# Altium project SC942C.PrjPcb (part 2 of 2)

## Sheet SC942C_STORRM.SchDoc: Sorties TOR Relais Monostable
size 393 x 270 mm; CompanyName: Seccom; Address1: 521, rue du capt. François Garbit; Address2: 69440 Mornant; Address3: seccom@seccom.fr; Address4: www.seccom.fr; DocumentNumber: 5; SheetNumber: 5; SheetTotal: 8; PageSetup: Record=PageOptions|CenterHorizontal=True|CenterVertical=True|PrintScale=0.74|XCorrection=1.00|YCorrection=1.00|PrintKind=0|BorderSize=5000000|LeftOffset=0|BottomOffset=0|Orientation=2|PaperLength=1000|PaperWidth=1000|Scale=100|PaperSource=7|PrintQuality=-4|MediaType=1|DitherType=10|PaperKind=A4|PrintScaleMode=1
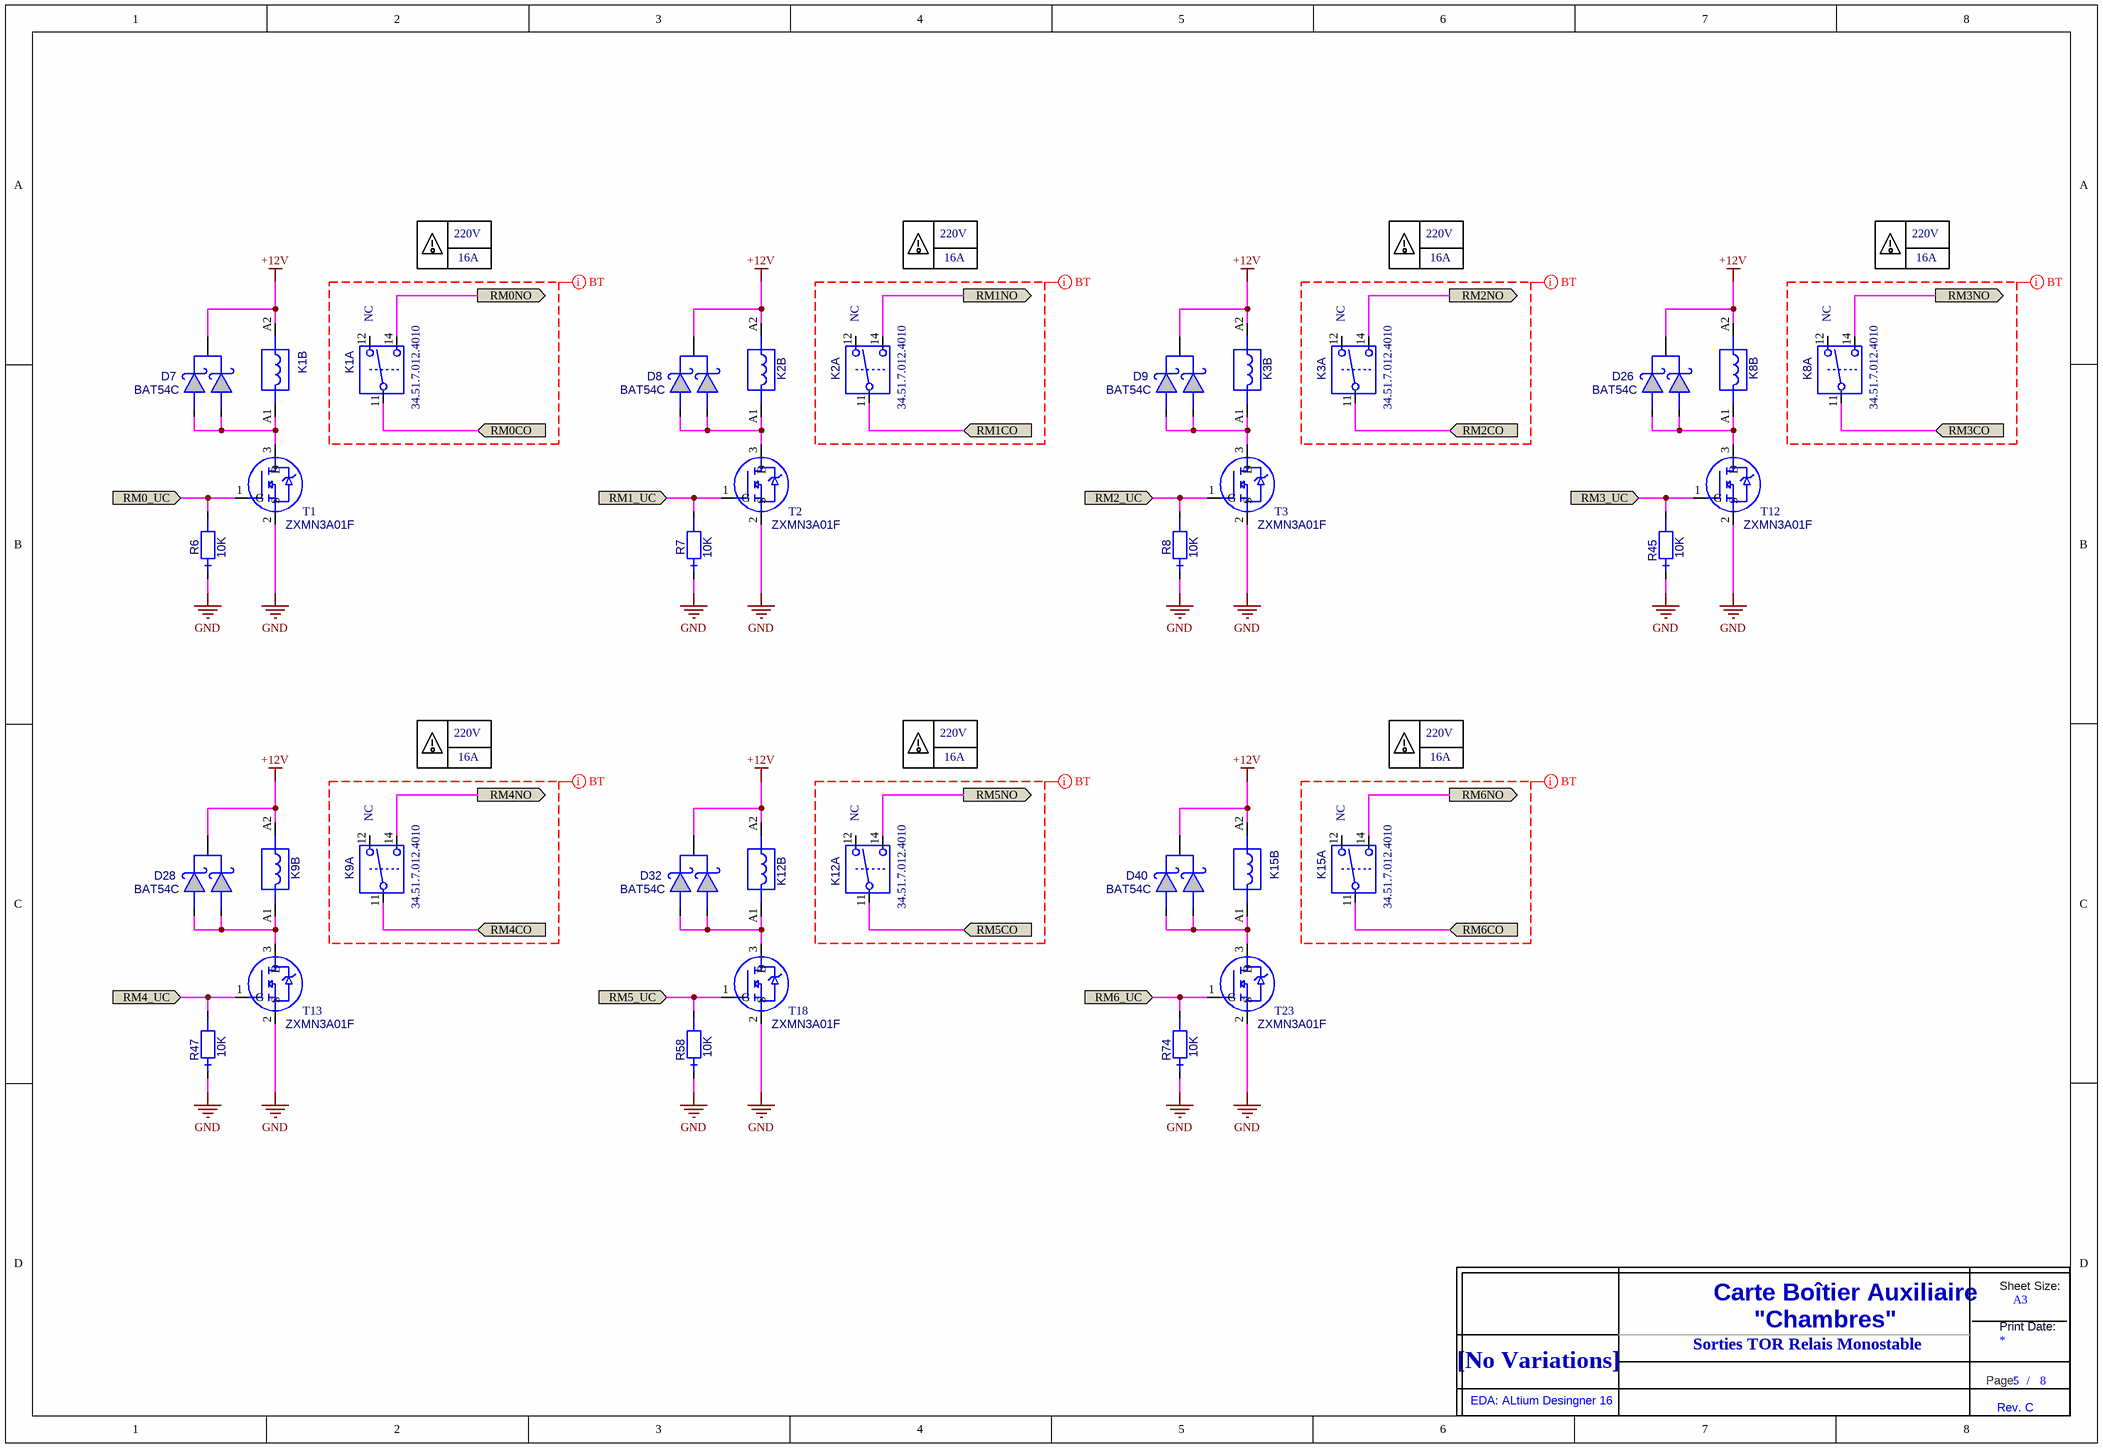
[diagram p5: SC942C_STORRM.SchDoc]

### Parts
(Parts that share a designator on the sheet are numbered #1, #2 ... from top to bottom, then left to right.)
D7  BAT54C  [SOT23_3L_ReflowSoldering]
D8  BAT54C  [SOT23_3L_ReflowSoldering]
D9  BAT54C  [SOT23_3L_ReflowSoldering]
D26  BAT54C  [SOT23_3L_ReflowSoldering]
D28  BAT54C  [SOT23_3L_ReflowSoldering]
D32  BAT54C  [SOT23_3L_ReflowSoldering]
D40  BAT54C  [SOT23_3L_ReflowSoldering]
K1  RELAY_12VDC_1RT_34.51  [RELAY_FINDER_34.51_+SUPPORT_93]  (value not drawn)  (parts A,B of 2)
K2  RELAY_12VDC_1RT_34.51  [RELAY_FINDER_34.51_+SUPPORT_93]  (value not drawn)  (parts A,B of 2)
K3  RELAY_12VDC_1RT_34.51  [RELAY_FINDER_34.51_+SUPPORT_93]  (value not drawn)  (parts A,B of 2)
K8  RELAY_12VDC_1RT_34.51  [RELAY_FINDER_34.51_+SUPPORT_93]  (value not drawn)  (parts A,B of 2)
K9  RELAY_12VDC_1RT_34.51  [RELAY_FINDER_34.51_+SUPPORT_93]  (value not drawn)  (parts A,B of 2)
K12  RELAY_12VDC_1RT_34.51  [RELAY_FINDER_34.51_+SUPPORT_93]  (value not drawn)  (parts A,B of 2)
K15  RELAY_12VDC_1RT_34.51  [RELAY_FINDER_34.51_+SUPPORT_93]  (value not drawn)  (parts A,B of 2)
R6  value 10K  [0805_ReflowSoldering_RES]  (hidden comment: RES_0805_1%_100PPM_10K)
R7  value 10K  [0805_ReflowSoldering_RES]  (hidden comment: RES_0805_1%_100PPM_10K)
R8  value 10K  [0805_ReflowSoldering_RES]  (hidden comment: RES_0805_1%_100PPM_10K)
R45  value 10K  [0805_ReflowSoldering_RES]  (hidden comment: RES_0805_1%_100PPM_10K)
R47  value 10K  [0805_ReflowSoldering_RES]  (hidden comment: RES_0805_1%_100PPM_10K)
R58  value 10K  [0805_ReflowSoldering_RES]  (hidden comment: RES_0805_1%_100PPM_10K)
R74  value 10K  [0805_ReflowSoldering_RES]  (hidden comment: RES_0805_1%_100PPM_10K)
T1  ZXMN3A01F  [SOT23_3L_ReflowSoldering]
T2  ZXMN3A01F  [SOT23_3L_ReflowSoldering]
T3  ZXMN3A01F  [SOT23_3L_ReflowSoldering]
T12  ZXMN3A01F  [SOT23_3L_ReflowSoldering]
T13  ZXMN3A01F  [SOT23_3L_ReflowSoldering]
T18  ZXMN3A01F  [SOT23_3L_ReflowSoldering]
T23  ZXMN3A01F  [SOT23_3L_ReflowSoldering]
Title_new?#5  DNI  (value not drawn)  (graphical)

### Ports
RM0_UC (in), RM0CO (in), RM0NO (out), RM1_UC (in), RM1CO (in), RM1NO (out), RM2_UC (in), RM2CO (in), RM2NO (out), RM3_UC (in), RM3CO (in), RM3NO (out), RM4_UC (in), RM4CO (in), RM4NO (out), RM5_UC (in), RM5CO (in), RM5NO (out), RM6_UC (in), RM6CO (in), RM6NO (out)

### Nets
+12V: D7.3 D8.3 D9.3 D26.3 D28.3 D32.3 D40.3 K1.A2 K2.A2 K3.A2 K8.A2 K9.A2 K12.A2 K15.A2
GND: R6.1 R7.1 R8.1 R45.1 R47.1 R58.1 R74.1 T1.2(S) T2.2(S) T3.2(S) T12.2(S) T13.2(S) T18.2(S) T23.2(S)
RM0_UC: R6.2 T1.1(G) ; port RM0_UC
RM0CO: K1.11(COM) ; port RM0CO
RM0NO: K1.14(NO) ; port RM0NO
RM1_UC: R7.2 T2.1(G) ; port RM1_UC
RM1CO: K2.11(COM) K3.11(COM) ; port RM1CO, port RM2CO
RM1NO: K2.14(NO) ; port RM1NO
RM2_UC: R8.2 T3.1(G) ; port RM2_UC
RM2NO: K3.14(NO) ; port RM2NO
RM3_UC: R45.2 T12.1(G) ; port RM3_UC
RM3CO: K8.11(COM) K9.11(COM) ; port RM3CO, port RM4CO
RM3NO: K8.14(NO) ; port RM3NO
RM4_UC: R47.2 T13.1(G) ; port RM4_UC
RM4NO: K9.14(NO) ; port RM4NO
RM5_UC: R58.2 T18.1(G) ; port RM5_UC
RM5CO: K12.11(COM) ; port RM5CO
RM5NO: K12.14(NO) ; port RM5NO
RM6_UC: R74.2 T23.1(G) ; port RM6_UC
RM6CO: K15.11(COM) ; port RM6CO
RM6NO: K15.14(NO) ; port RM6NO
NetD7_1: D7.1 D7.2 K1.A1 T1.3(D)
NetD8_1: D8.1 D8.2 K2.A1 T2.3(D)
NetD9_1: D9.1 D9.2 K3.A1 T3.3(D)
NetD26_1: D26.1 D26.2 K8.A1 T12.3(D)
NetD28_1: D28.1 D28.2 K9.A1 T13.3(D)
NetD32_1: D32.1 D32.2 K12.A1 T18.3(D)
NetD40_1: D40.1 D40.2 K15.A1 T23.3(D)

Not connected (* = marked no-connect by the designer): K1 12(NC); K2 12(NC); K3 12(NC); K8 12(NC); K9 12(NC); K12 12(NC); K15 12(NC)

### Layout directives
net class BT: (no net found under the mark)

### Notes on the sheet
- 220V
- (near K1) NC
- 16A
- (near K2) NC
- (near K3) NC
- (near K8) NC
- (near K9) NC
- (near K12) NC
- (near K15) NC
- Sorties TOR Relais Monostable
- (in symbol Title_new_1) Sheet Size:; Carte Boîtier Auxiliaire; A3; "Chambres"; Print Date:; [No Variations]; Page:; /; EDA: ALtium Desingner 16; Rev. C

### Library data of the parts
D7-D9 D26 D28 D32 D40 = BAT54C: Diode Schottky double, BAT54 cathode com, Vrrm=30V, If=300mA, Vf=0.4Vmax, CMS; Creation: LJ (14/05/02); Reference: 000597/00; Boitier: SOT23_3L; Remarque: {Remarque}; Fabricant: NXP; Coeff: 1; Verification: LJ (14/05/02); Ref Fab: BAT54C; ComponentLink1URL: o:\_Documentation\Datasheets\NXP\BAT54_series.pdf; ComponentLink2URL: o:\_Documentation\Datasheets\_BOITIERS\ACTIF_CMS\SOT\SOT_23_3P_(Schneider).PDF; Config: *; ComponentLink1Description: Datasheet; ComponentLink2Description: Datasheet Boitier; Value: BAT54C; Supplier 1: Farnell; Supplier Part Number 1: 1081192
K1-K3 K8 K9 K12 K15 = RELAY_12VDC_1RT_34.51: Relais 1RT, 12Vdc, série 34.51, Rc=1940R, Sw:250Vac/6A, Ron=? (AgSnO2); Creation: CHD; Verification: LJ (24/11/11); Boitier: DIP12 Form C; Remarque: {Remarque}; Fabricant: Finder; Ref Fab: 34.51.7.012.4010; Coeff: 1; Value: 34.51.7.012.4010; ComponentLink1URL: o:\_Documentation\Datasheets\Finder\Relais_Serie_34.pdf; ComponentLink2URL: o:\_Documentation\Datasheets\_BOITIERS\; Config: *; ComponentLink1Description: Datasheet; ComponentLink2Description: Datasheet Boitier
R6-R8 R45 R47 R58 R74 = RES_0805_1%_100PPM_10K: Résistance CMS 0805, 0.125W, 1%, 100ppm, 150V; Creation: LJ (06/02/09); Reference: 000063/00; Boitier: 0805; Remarque: {Remarque}; Fabricant: Yageo; Ref Fab: RC0805FR-0710KL; Coeff: 1; Verification: *; ComponentLink1URL: o:\_Documentation\Datasheets\BC_Components\Resistances_ThickFilmFlatChip_0402-0603-0805-1206.pdf; ComponentLink2URL: o:\_Documentation\Datasheets\_BOITIERS\PASSIF_CMS\RC_0805_(2x1,25)_(Schneider).PDF; Config: *; ComponentLink1Description: Datasheet; ComponentLink2Description: Datasheet Boitier; Supplier 1: Farnell; Supplier Part Number 1: 9237755
T1-T3 T12 T13 T18 T23 = ZXMN3A01F: Transistor MOSN logique, Vdss=30V, Id=2A, Rdson=0.12R, CMS; Boitier: SOT23_3L; Remarque: {Remarque}; Creation: CHD; Fabricant: Zetex; Coeff: 1; Ref Fab: ZXMN3A01F; ComponentLink1URL: o:\_Documentation\Datasheets\; ComponentLink2URL: o:\_Documentation\Datasheets\_BOITIERS\ACTIF_CMS\SOT\SOT_23_3P_(Schneider).PDF; Config: *; ComponentLink1Description: Datasheet; Value: ZXMN3A01F; Supplier 1: Farnell; Supplier 2: Mouser; Supplier Part Number 1: 9525734; Supplier Part Number 2: 522-ZXMN3A01FTA
Title_new?#5 = Title_new_1

## Sheet SC942C_Variateurs.SchDoc: Variateurs
size 393 x 270 mm; CompanyName: Seccom; Address1: 521, rue du capt. François Garbit; Address2: 69440 Mornant; Address3: seccom@seccom.fr; Address4: www.seccom.fr; DocumentNumber: 6; SheetNumber: 6; SheetTotal: 8; PageSetup: Record=PageOptions|CenterHorizontal=True|CenterVertical=True|PrintScale=0.74|XCorrection=1.00|YCorrection=1.00|PrintKind=0|BorderSize=5000000|LeftOffset=0|BottomOffset=0|Orientation=2|PaperLength=1000|PaperWidth=1000|Scale=100|PaperSource=7|PrintQuality=-4|MediaType=1|DitherType=10|PaperKind=A4|PrintScaleMode=1
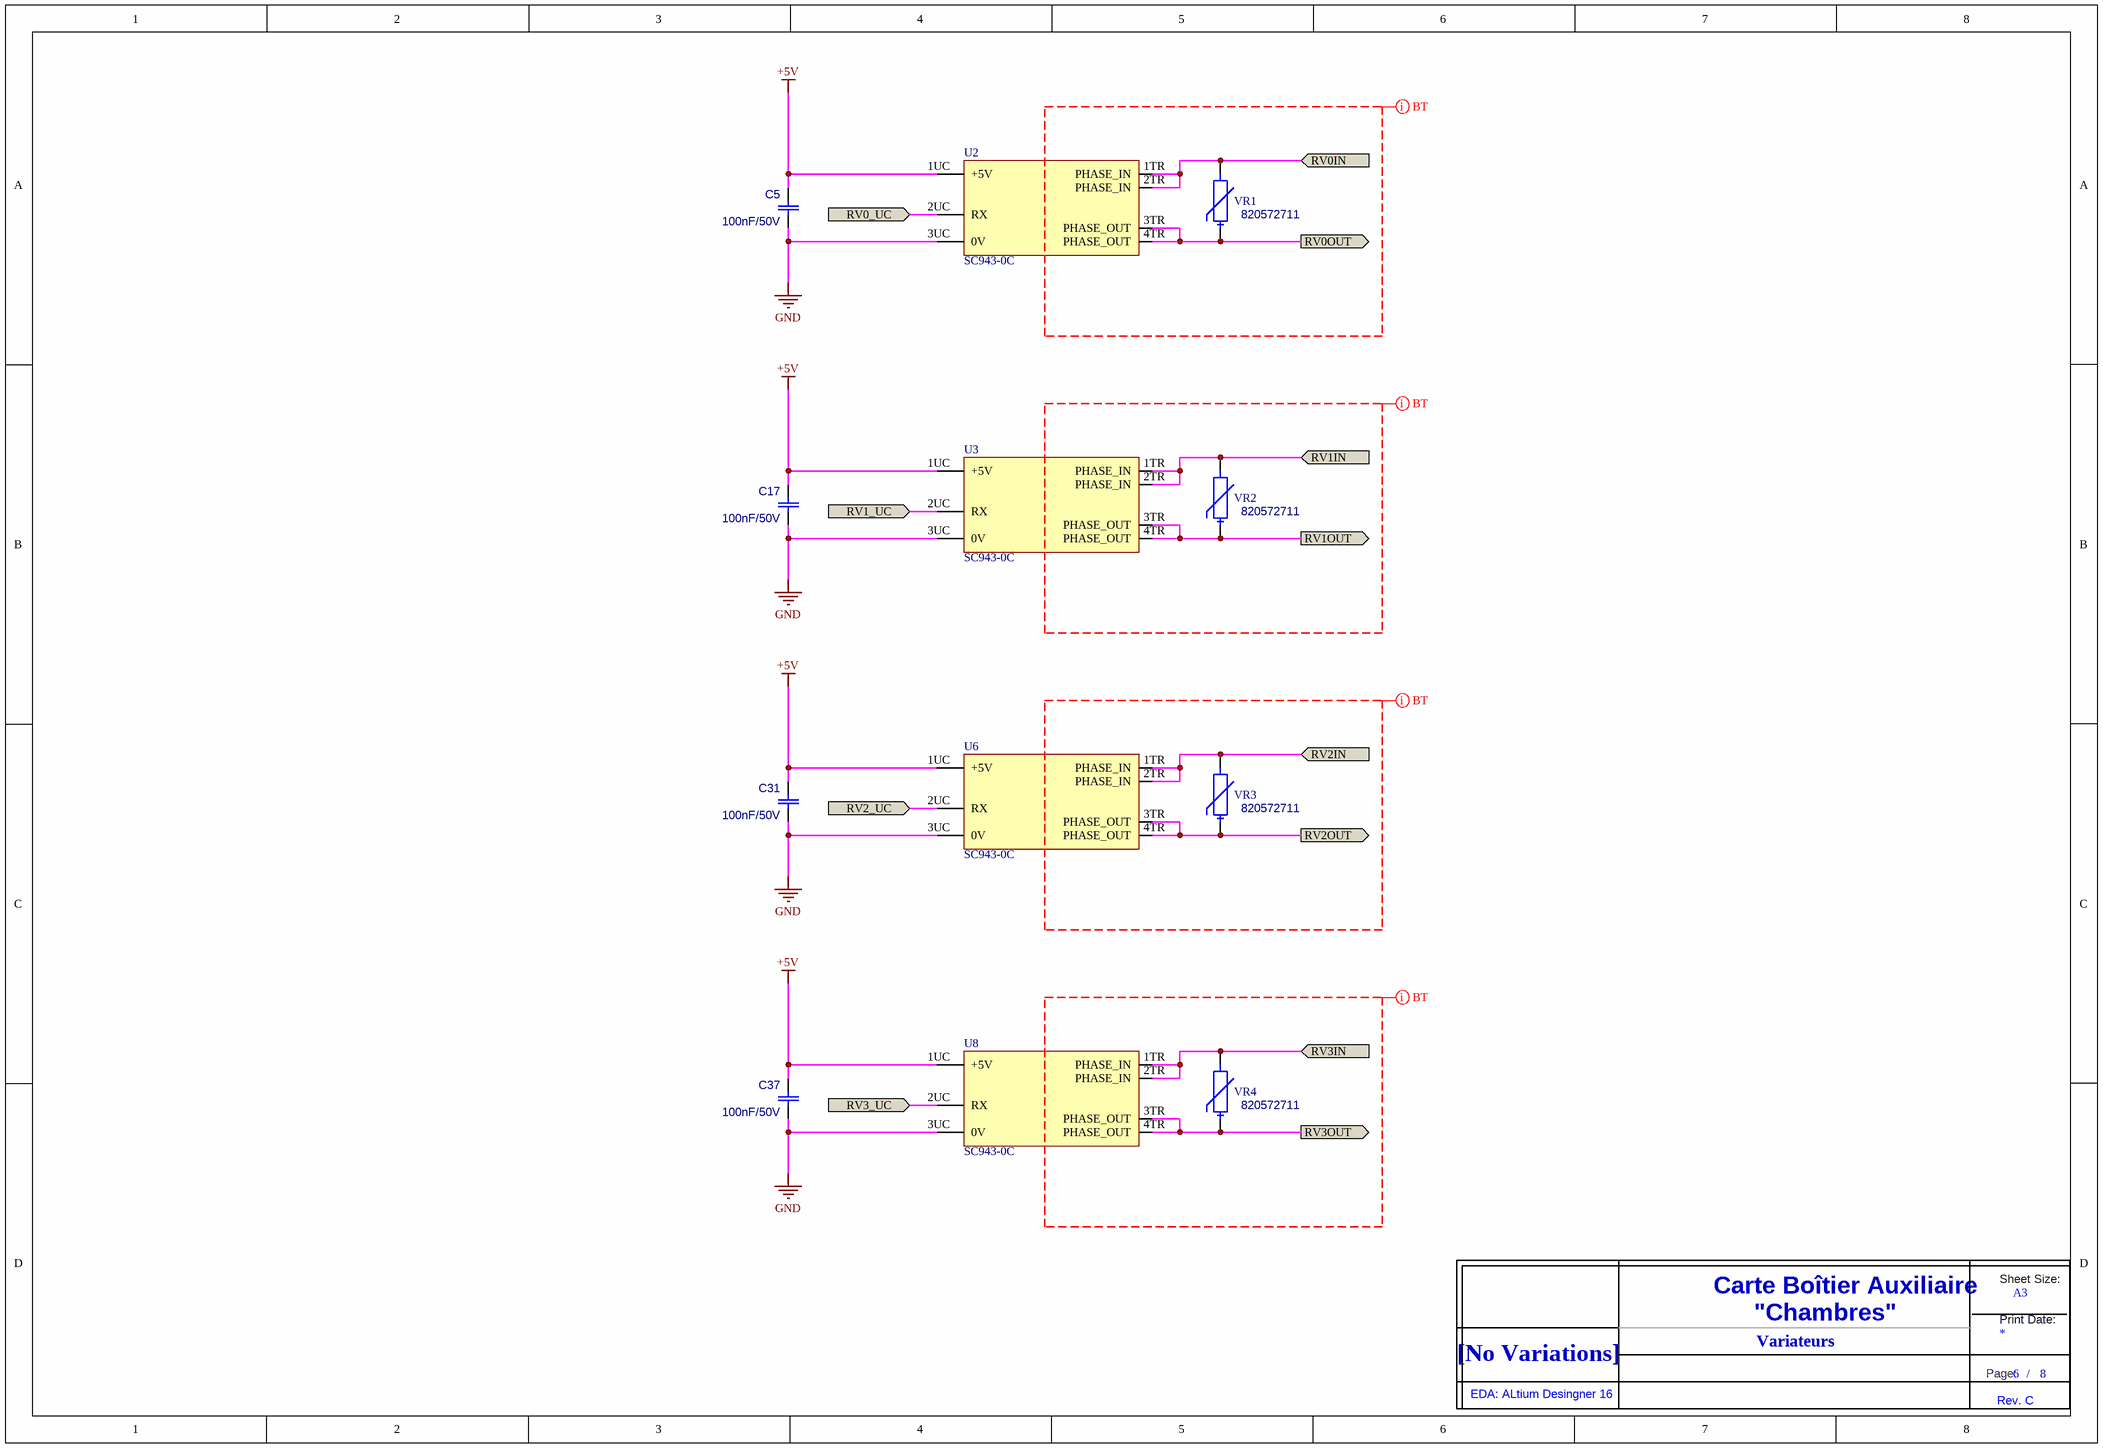
[diagram p6: SC942C_Variateurs.SchDoc]

### Parts
(Parts that share a designator on the sheet are numbered #1, #2 ... from top to bottom, then left to right.)
C5  value 100nF/50V  [0805_ReflowSoldering_CAP]  (hidden comment: C_0805_X7R_10%_100N-50V)
C17  value 100nF/50V  [0805_ReflowSoldering_CAP]  (hidden comment: C_0805_X7R_10%_100N-50V)
C31  value 100nF/50V  [0805_ReflowSoldering_CAP]  (hidden comment: C_0805_X7R_10%_100N-50V)
C37  value 100nF/50V  [0805_ReflowSoldering_CAP]  (hidden comment: C_0805_X7R_10%_100N-50V)
Title_new?#6  DNI  (value not drawn)  (graphical)
U2  SC943-0C  [SI943C_REV_A]
U3  SC943-0C  [SI943C_REV_A]
U6  SC943-0C  [SI943C_REV_A]
U8  SC943-0C  [SI943C_REV_A]
VR1  value 820572711  [VDR_Serie_820_d7_h13_e5mm]  (hidden comment: VDR_820572711)
VR2  value 820572711  [VDR_Serie_820_d7_h13_e5mm]  (hidden comment: VDR_820572711)
VR3  value 820572711  [VDR_Serie_820_d7_h13_e5mm]  (hidden comment: VDR_820572711)
VR4  value 820572711  [VDR_Serie_820_d7_h13_e5mm]  (hidden comment: VDR_820572711)

### Ports
RV0_UC (in), RV0IN (in), RV0OUT (out), RV1_UC (in), RV1IN (in), RV1OUT (out), RV2_UC (in), RV2IN (in), RV2OUT (out), RV3_UC (in), RV3IN (in), RV3OUT (out)

### Nets
+5V: C5.1 C17.1 C31.1 C37.1 U2.1UC(+5V) U3.1UC(+5V) U6.1UC(+5V) U8.1UC(+5V)
GND: C5.2 C17.2 C31.2 C37.2 U2.3UC(0V) U3.3UC(0V) U6.3UC(0V) U8.3UC(0V)
RV0_UC: U2.2UC(RX) ; port RV0_UC
RV0IN: U2.1TR(PHASE_IN) U2.2TR(PHASE_IN) VR1.2 ; port RV0IN
RV0OUT: U2.3TR(PHASE_OUT) U2.4TR(PHASE_OUT) VR1.1 ; port RV0OUT
RV1_UC: U3.2UC(RX) ; port RV1_UC
RV1IN: U3.1TR(PHASE_IN) U3.2TR(PHASE_IN) VR2.2 ; port RV1IN
RV1OUT: U3.3TR(PHASE_OUT) U3.4TR(PHASE_OUT) VR2.1 ; port RV1OUT
RV2_UC: U6.2UC(RX) ; port RV2_UC
RV2IN: U6.1TR(PHASE_IN) U6.2TR(PHASE_IN) VR3.2 ; port RV2IN
RV2OUT: U6.3TR(PHASE_OUT) U6.4TR(PHASE_OUT) VR3.1 ; port RV2OUT
RV3_UC: U8.2UC(RX) ; port RV3_UC
RV3IN: U8.1TR(PHASE_IN) U8.2TR(PHASE_IN) VR4.2 ; port RV3IN
RV3OUT: U8.3TR(PHASE_OUT) U8.4TR(PHASE_OUT) VR4.1 ; port RV3OUT

### Layout directives
net class BT: (no net found under the mark)

### Notes on the sheet
- Variateurs
- (in symbol Title_new_1) Sheet Size:; Carte Boîtier Auxiliaire; A3; "Chambres"; Print Date:; [No Variations]; Page:; /; EDA: ALtium Desingner 16; Rev. C

### Library data of the parts
C5 C17 C31 C37 = C_0805_X7R_10%_100N-50V: Condensateur céramique, X7R, 10%, CMS 0805; Creation: LJ; Verification: LJ (28/05/04); Reference: 000042/00; Boitier: 0805; Remarque: {Remarque}; Fabricant: AVX; Ref Fab: 08055C104KAT2A; Coeff: 1; ComponentLink1URL: o:\_Documentation\Datasheets\BC_Components\Condo_CMS_NPO-X7R-Y5V.pdf; ComponentLink2URL: o:\_Documentation\Datasheets\_BOITIERS\PASSIF_CMS\RC_0805_(2x1,25)_(Schneider).PDF; Config: *; ComponentLink1Description: Datasheet; ComponentLink2Description: Datasheet Boitier; Supplier 1: Farnell; Supplier Part Number 1: 499687
Title_new?#6 = Title_new_1
U2 U3 U6 U8 = SC943-0C: Carte gradateur; Boitier: SI943C; Coeff: 1; Fabricant: Valentinéa; Remarque: {Remarque}; Ref Fab: SC943-0C; Value: SC943-0C
VR1-VR4 = VDR_820572711: Varistance disque 275Vac, 350Vdc, 33J, Vbreak=430V@1mA, Vclamp=710V@10A, Ipeak=1200A; Creation: LJ (12/01/12); Reference: {Reference}; Boitier: d7_t4.6_h13_e5mm; Remarque: {Remarque}; Fabricant: Wurth Elektronik; Coeff: 1; Ref Fab: 820572711; ComponentLink1URL: o:\_Documentation\Datasheets\Wurth_Elektronik\Varistance_820572711.pdf; ComponentLink2URL: o:\_Documentation\Datasheets\; Config: *; ComponentLink1Description: Datasheet; ComponentLink2Description: Datasheet Boitier

## Sheet SC942C_STORRB.SchDoc: Sorties TOR Relais Bistable
size 393 x 270 mm; CompanyName: Seccom; Address1: 521, rue du capt. François Garbit; Address2: 69440 Mornant; Address3: seccom@seccom.fr; Address4: www.seccom.fr; DocumentNumber: 7; SheetNumber: 7; SheetTotal: 8; PageSetup: Record=PageOptions|CenterHorizontal=True|CenterVertical=True|PrintScale=0.74|XCorrection=1.00|YCorrection=1.00|PrintKind=0|BorderSize=5000000|LeftOffset=0|BottomOffset=0|Orientation=2|PaperLength=1000|PaperWidth=1000|Scale=100|PaperSource=7|PrintQuality=-4|MediaType=1|DitherType=10|PaperKind=A4|PrintScaleMode=1
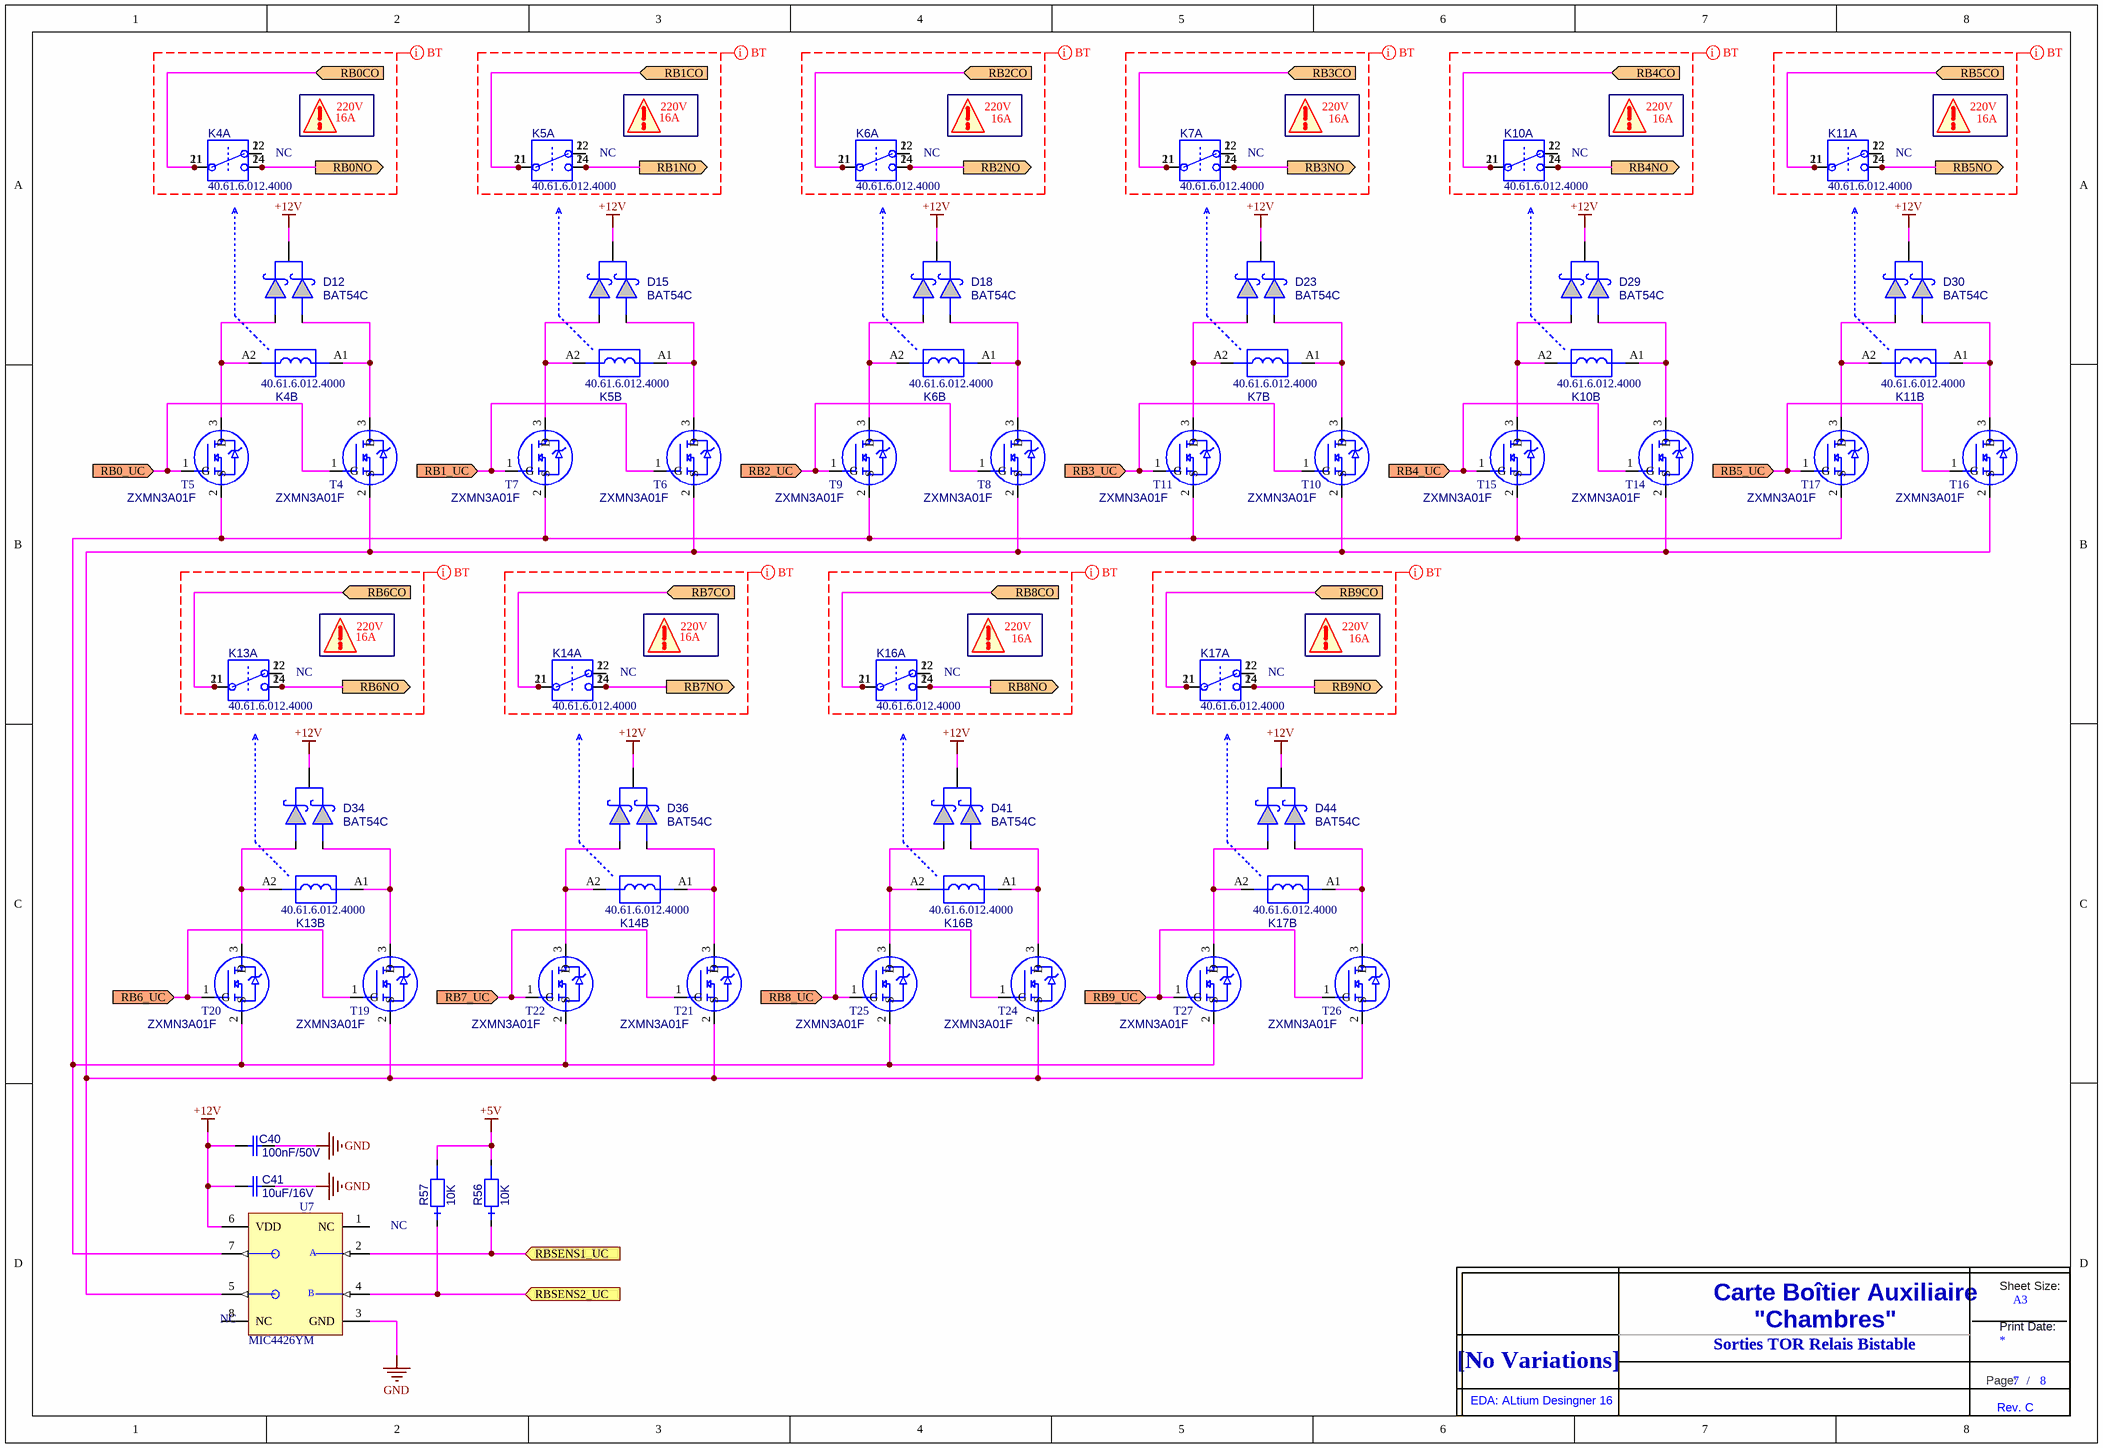
[diagram p7: SC942C_STORRB.SchDoc]

### Parts
(Parts that share a designator on the sheet are numbered #1, #2 ... from top to bottom, then left to right.)
C40  value 100nF/50V  [0805_ReflowSoldering_CAP]  (hidden comment: C_0805_X7R_10%_100N-50V)
C41  value 10uF/16V  [0805_ReflowSoldering_CAP]  (hidden comment: C_0805_X5R_10%_10U-16V)
D12  BAT54C  [SOT23_3L_ReflowSoldering]
D15  BAT54C  [SOT23_3L_ReflowSoldering]
D18  BAT54C  [SOT23_3L_ReflowSoldering]
D23  BAT54C  [SOT23_3L_ReflowSoldering]
D29  BAT54C  [SOT23_3L_ReflowSoldering]
D30  BAT54C  [SOT23_3L_ReflowSoldering]
D34  BAT54C  [SOT23_3L_ReflowSoldering]
D36  BAT54C  [SOT23_3L_ReflowSoldering]
D41  BAT54C  [SOT23_3L_ReflowSoldering]
D44  BAT54C  [SOT23_3L_ReflowSoldering]
K4  value 40.61.6.012.4000  [RELAY_FINDER_40.61_+SUPPORT_95]  (hidden comment: RELAY_12VDC_1RT_BI_40.61.6)  (parts A,B of 2)
K5  value 40.61.6.012.4000  [RELAY_FINDER_40.61_+SUPPORT_95]  (hidden comment: RELAY_12VDC_1RT_BI_40.61.6)  (parts A,B of 2)
K6  value 40.61.6.012.4000  [RELAY_FINDER_40.61_+SUPPORT_95]  (hidden comment: RELAY_12VDC_1RT_BI_40.61.6)  (parts A,B of 2)
K7  value 40.61.6.012.4000  [RELAY_FINDER_40.61_+SUPPORT_95]  (hidden comment: RELAY_12VDC_1RT_BI_40.61.6)  (parts A,B of 2)
K10  value 40.61.6.012.4000  [RELAY_FINDER_40.61_+SUPPORT_95]  (hidden comment: RELAY_12VDC_1RT_BI_40.61.6)  (parts A,B of 2)
K11  value 40.61.6.012.4000  [RELAY_FINDER_40.61_+SUPPORT_95]  (hidden comment: RELAY_12VDC_1RT_BI_40.61.6)  (parts A,B of 2)
K13  value 40.61.6.012.4000  [RELAY_FINDER_40.61_+SUPPORT_95]  (hidden comment: RELAY_12VDC_1RT_BI_40.61.6)  (parts A,B of 2)
K14  value 40.61.6.012.4000  [RELAY_FINDER_40.61_+SUPPORT_95]  (hidden comment: RELAY_12VDC_1RT_BI_40.61.6)  (parts A,B of 2)
K16  value 40.61.6.012.4000  [RELAY_FINDER_40.61_+SUPPORT_95]  (hidden comment: RELAY_12VDC_1RT_BI_40.61.6)  (parts A,B of 2)
K17  value 40.61.6.012.4000  [RELAY_FINDER_40.61_+SUPPORT_95]  (hidden comment: RELAY_12VDC_1RT_BI_40.61.6)  (parts A,B of 2)
R56  value 10K  [0805_ReflowSoldering_RES]  (hidden comment: RES_0805_1%_100PPM_10K)
R57  value 10K  [0805_ReflowSoldering_RES]  (hidden comment: RES_0805_1%_100PPM_10K)
T4  ZXMN3A01F  [SOT23_3L_ReflowSoldering]
T5  ZXMN3A01F  [SOT23_3L_ReflowSoldering]
T6  ZXMN3A01F  [SOT23_3L_ReflowSoldering]
T7  ZXMN3A01F  [SOT23_3L_ReflowSoldering]
T8  ZXMN3A01F  [SOT23_3L_ReflowSoldering]
T9  ZXMN3A01F  [SOT23_3L_ReflowSoldering]
T10  ZXMN3A01F  [SOT23_3L_ReflowSoldering]
T11  ZXMN3A01F  [SOT23_3L_ReflowSoldering]
T14  ZXMN3A01F  [SOT23_3L_ReflowSoldering]
T15  ZXMN3A01F  [SOT23_3L_ReflowSoldering]
T16  ZXMN3A01F  [SOT23_3L_ReflowSoldering]
T17  ZXMN3A01F  [SOT23_3L_ReflowSoldering]
T19  ZXMN3A01F  [SOT23_3L_ReflowSoldering]
T20  ZXMN3A01F  [SOT23_3L_ReflowSoldering]
T21  ZXMN3A01F  [SOT23_3L_ReflowSoldering]
T22  ZXMN3A01F  [SOT23_3L_ReflowSoldering]
T24  ZXMN3A01F  [SOT23_3L_ReflowSoldering]
T25  ZXMN3A01F  [SOT23_3L_ReflowSoldering]
T26  ZXMN3A01F  [SOT23_3L_ReflowSoldering]
T27  ZXMN3A01F  [SOT23_3L_ReflowSoldering]
Title_new?#7  DNI  (value not drawn)  (graphical)
U7  MIC4426YM  [SOIC_08_E1,27_L150_ReflowSoldering]

### Ports
RB0_UC (in), RB0CO (in), RB0NO (out), RB1_UC (in), RB1CO (in), RB1NO (out), RB2_UC (in), RB2CO (in), RB2NO (out), RB3_UC (in), RB3CO (in), RB3NO (out), RB4_UC (in), RB4CO (in), RB4NO (out), RB5_UC (in), RB5CO (in), RB5NO (out), RB6_UC (in), RB6CO (in), RB6NO (out), RB7_UC (in), RB7CO (in), RB7NO (out), RB8_UC (in), RB8CO (in), RB8NO (out), RB9_UC (in), RB9CO (in), RB9NO (out), RBSENS1_UC (in), RBSENS2_UC (in)

### Nets
+5V: R56.2 R57.2
+12V: C40.1 C41.2 D12.3 D15.3 D18.3 D23.3 D29.3 D30.3 D34.3 D36.3 D41.3 D44.3 U7.6(VDD)
GND: C40.2 C41.1 U7.3(GND)
RB0_UC: T4.1(G) T5.1(G) ; port RB0_UC
RB0CO: K4.11(COM) K4.21(COM) K5.11(COM) K5.21(COM) K6.11(COM) K6.21(COM) K7.11(COM) K7.21(COM) ; port RB0CO, port RB1CO, port RB2CO, port RB3CO
RB0NO: K4.14(NO) K4.24(NO) ; port RB0NO
RB1_UC: T6.1(G) T7.1(G) ; port RB1_UC
RB1NO: K5.14(NO) K5.24(NO) ; port RB1NO
RB2_UC: T8.1(G) T9.1(G) ; port RB2_UC
RB2NO: K6.14(NO) K6.24(NO) ; port RB2NO
RB3_UC: T10.1(G) T11.1(G) ; port RB3_UC
RB3NO: K7.14(NO) K7.24(NO) ; port RB3NO
RB4_UC: T14.1(G) T15.1(G) ; port RB4_UC
RB4CO: K10.11(COM) K10.21(COM) K11.11(COM) K11.21(COM) ; port RB4CO, port RB5CO
RB4NO: K10.14(NO) K10.24(NO) ; port RB4NO
RB5_UC: T16.1(G) T17.1(G) ; port RB5_UC
RB5NO: K11.14(NO) K11.24(NO) ; port RB5NO
RB6_UC: T19.1(G) T20.1(G) ; port RB6_UC
RB6CO: K13.11(COM) K13.21(COM) K14.11(COM) K14.21(COM) ; port RB6CO, port RB7CO
RB6NO: K13.14(NO) K13.24(NO) ; port RB6NO
RB7_UC: T21.1(G) T22.1(G) ; port RB7_UC
RB7NO: K14.14(NO) K14.24(NO) ; port RB7NO
RB8_UC: T24.1(G) T25.1(G) ; port RB8_UC
RB8CO: K16.11(COM) K16.21(COM) K17.11(COM) K17.21(COM) ; port RB8CO, port RB9CO
RB8NO: K16.14(NO) K16.24(NO) ; port RB8NO
RB9_UC: T26.1(G) T27.1(G) ; port RB9_UC
RB9NO: K17.14(NO) K17.24(NO) ; port RB9NO
RBSENS1_UC: R56.1 U7.2(INA) ; port RBSENS1_UC
RBSENS2_UC: R57.1 U7.4(INB) ; port RBSENS2_UC
NetD12_1: D12.1 K4.A1 T4.3(D)
NetD12_2: D12.2 K4.A2 T5.3(D)
NetD15_1: D15.1 K5.A1 T6.3(D)
NetD15_2: D15.2 K5.A2 T7.3(D)
NetD18_1: D18.1 K6.A1 T8.3(D)
NetD18_2: D18.2 K6.A2 T9.3(D)
NetD23_1: D23.1 K7.A1 T10.3(D)
NetD23_2: D23.2 K7.A2 T11.3(D)
NetD29_1: D29.1 K10.A1 T14.3(D)
NetD29_2: D29.2 K10.A2 T15.3(D)
NetD30_1: D30.1 K11.A1 T16.3(D)
NetD30_2: D30.2 K11.A2 T17.3(D)
NetD34_1: D34.1 K13.A1 T19.3(D)
NetD34_2: D34.2 K13.A2 T20.3(D)
NetD36_1: D36.1 K14.A1 T21.3(D)
NetD36_2: D36.2 K14.A2 T22.3(D)
NetD41_1: D41.1 K16.A1 T24.3(D)
NetD41_2: D41.2 K16.A2 T25.3(D)
NetD44_1: D44.1 K17.A1 T26.3(D)
NetD44_2: D44.2 K17.A2 T27.3(D)
NetK4_12: K4.12(NC) K4.22(NC)
NetK5_12: K5.12(NC) K5.22(NC)
NetK6_12: K6.12(NC) K6.22(NC)
NetK7_12: K7.12(NC) K7.22(NC)
NetK10_12: K10.12(NC) K10.22(NC)
NetK11_12: K11.12(NC) K11.22(NC)
NetK13_12: K13.12(NC) K13.22(NC)
NetK14_12: K14.12(NC) K14.22(NC)
NetK16_12: K16.12(NC) K16.22(NC)
NetK17_12: K17.12(NC) K17.22(NC)
NetT4_2: T4.2(S) T6.2(S) T8.2(S) T10.2(S) T14.2(S) T16.2(S) T19.2(S) T21.2(S) T24.2(S) T26.2(S) U7.5(~{OUTB})
NetT5_2: T5.2(S) T7.2(S) T9.2(S) T11.2(S) T15.2(S) T17.2(S) T20.2(S) T22.2(S) T25.2(S) T27.2(S) U7.7(~{OUTA})

Not connected (* = marked no-connect by the designer): U7 1(NC) 8(NC)

### Layout directives
net class BT: (no net found under the mark)

### Notes on the sheet
- 16A
- 220V
- (near K4) NC
- (near K5) NC
- (near K6) NC
- (near K7) NC
- (near K10) NC
- (near K11) NC
- (near K13) NC
- (near K14) NC
- (near K16) NC
- (near K17) NC
- NC
- (near U7) NC
- Sorties TOR Relais Bistable
- (in symbol MIC4426YM) A; B
- (in symbol Title_new_1) Sheet Size:; Carte Boîtier Auxiliaire; A3; "Chambres"; Print Date:; [No Variations]; Page:; /; EDA: ALtium Desingner 16; Rev. C

### Library data of the parts
C40 = C_0805_X7R_10%_100N-50V: as C5 on sheet SC942C_Variateurs; ComponentLink1URL: o:\_Documentation\Datasheets\BC_Components\Condo_CMS_NPO-X7R-Y5V.pdf; ComponentLink2URL: o:\_Documentation\Datasheets\_BOITIERS\PASSIF_CMS\RC_0805_(2x1,25)_(Schneider).PDF; Config: *; ComponentLink1Description: Datasheet; ComponentLink2Description: Datasheet Boitier; Supplier 1: Farnell; Supplier Part Number 1: 499687
C41 = C_0805_X5R_10%_10U-16V: Condensateur céramique, X5R, 10%, CMS 0805; Creation: LJ (12/09/11); Reference: 001715/00; Boitier: 0805; Remarque: {Remarque}; Coeff: 1; Fabricant: Murata; Ref Fab: GRM219R61C106KA73D; Verification: *; ComponentLink1URL: o:\_Documentation\Datasheets\; ComponentLink2URL: o:\_Documentation\Datasheets\_Boitiers\PASSIF_CMS\RC_0805_(2x1,25)_(Schneider).pdf; Config: *; ComponentLink1Description: Datasheet; ComponentLink2Description: Datasheet Boitier
D12 D15 D18 D23 D29 D30 D34 D36 D41 D44 = BAT54C: as D7 on sheet SC942C_STORRM; Verification: LJ (14/05/02); Ref Fab: BAT54C; ComponentLink1URL: o:\_Documentation\Datasheets\NXP\BAT54_series.pdf; ComponentLink2URL: o:\_Documentation\Datasheets\_BOITIERS\ACTIF_CMS\SOT\SOT_23_3P_(Schneider).PDF; Config: *; ComponentLink1Description: Datasheet; ComponentLink2Description: Datasheet Boitier; Value: BAT54C; Supplier 1: Farnell; Supplier Part Number 1: 1081192
K4-K7 K10 K11 K13 K14 K16 K17 = RELAY_12VDC_1RT_BI_40.61.6: Relais 1RT, 12Vdc, série 40.61.6 (bistable), Rc=900R, Sw:250Vac/16A, Ron=? (AgSnO2); Creation: CHD; Verification: LJ (24/11/11); Boitier: type DIP16; Remarque: {Remarque}; Fabricant: Finder; Coeff: 1; Ref Fab: 40.61.6.012.4000; ComponentLink1URL: o:\_Documentation\Datasheets\Finder\Relais_Serie_40.pdf; ComponentLink2URL: o:\_Documentation\Datasheets\_BOITIERS\; Config: *; ComponentLink1Description: Datasheet; ComponentLink2Description: Datasheet Boitier
R56 R57 = RES_0805_1%_100PPM_10K: as R6 on sheet SC942C_STORRM; Verification: *; ComponentLink1URL: o:\_Documentation\Datasheets\BC_Components\Resistances_ThickFilmFlatChip_0402-0603-0805-1206.pdf; ComponentLink2URL: o:\_Documentation\Datasheets\_BOITIERS\PASSIF_CMS\RC_0805_(2x1,25)_(Schneider).PDF; Config: *; ComponentLink1Description: Datasheet; ComponentLink2Description: Datasheet Boitier; Supplier 1: Farnell; Supplier Part Number 1: 9237755
T4-T11 T14-T17 T19-T22 T24-T27 = ZXMN3A01F: as T1 on sheet SC942C_STORRM; Ref Fab: ZXMN3A01F; ComponentLink1URL: o:\_Documentation\Datasheets\; ComponentLink2URL: o:\_Documentation\Datasheets\_BOITIERS\ACTIF_CMS\SOT\SOT_23_3P_(Schneider).PDF; Config: *; ComponentLink1Description: Datasheet; Value: ZXMN3A01F; Supplier 1: Farnell; Supplier 2: Mouser; Supplier Part Number 1: 9525734; Supplier Part Number 2: 522-ZXMN3A01FTA
Title_new?#7 = Title_new_1
U7 = MIC4426YM: Dual High-Speed 1.5A MOSFET Driver, CMS; Creation: CHD; Verification: LJ (); Boitier: SO8_L150; Remarque: {Remarque}; Fabricant: Micrel; Coeff: 1; Ref Fab: MIC4426YM; ComponentLink1URL: o:\_Documentation\Datasheets\; ComponentLink2URL: o:\_Documentation\Datasheets\_Boitiers\ACTIF_CMS\SOIC\SOIC_08_e1,27_L150_(Schneider).PDF; Config: *; ComponentLink1Description: Datasheet; ComponentLink2Description: Datasheet Boitier; Value: MIC4426YM

## Sheet SC942C-0B_Borniers.SchDoc: Borniers
size 393 x 270 mm; CompanyName: Seccom; Address1: 521, rue du capt. François Garbit; Address2: 69440 Mornant; Address3: seccom@seccom.fr; Address4: www.seccom.fr; DocumentNumber: 8; SheetNumber: 8; SheetTotal: 8; PageSetup: Record=PageOptions|CenterHorizontal=True|CenterVertical=True|PrintScale=0.71|XCorrection=1.00|YCorrection=1.00|PrintKind=0|BorderSize=5000000|LeftOffset=0|BottomOffset=0|Orientation=2|PaperLength=1000|PaperWidth=1000|Scale=100|PaperSource=7|PrintQuality=-4|MediaType=1|DitherType=10|PaperKind=A4|PrintScaleMode=1
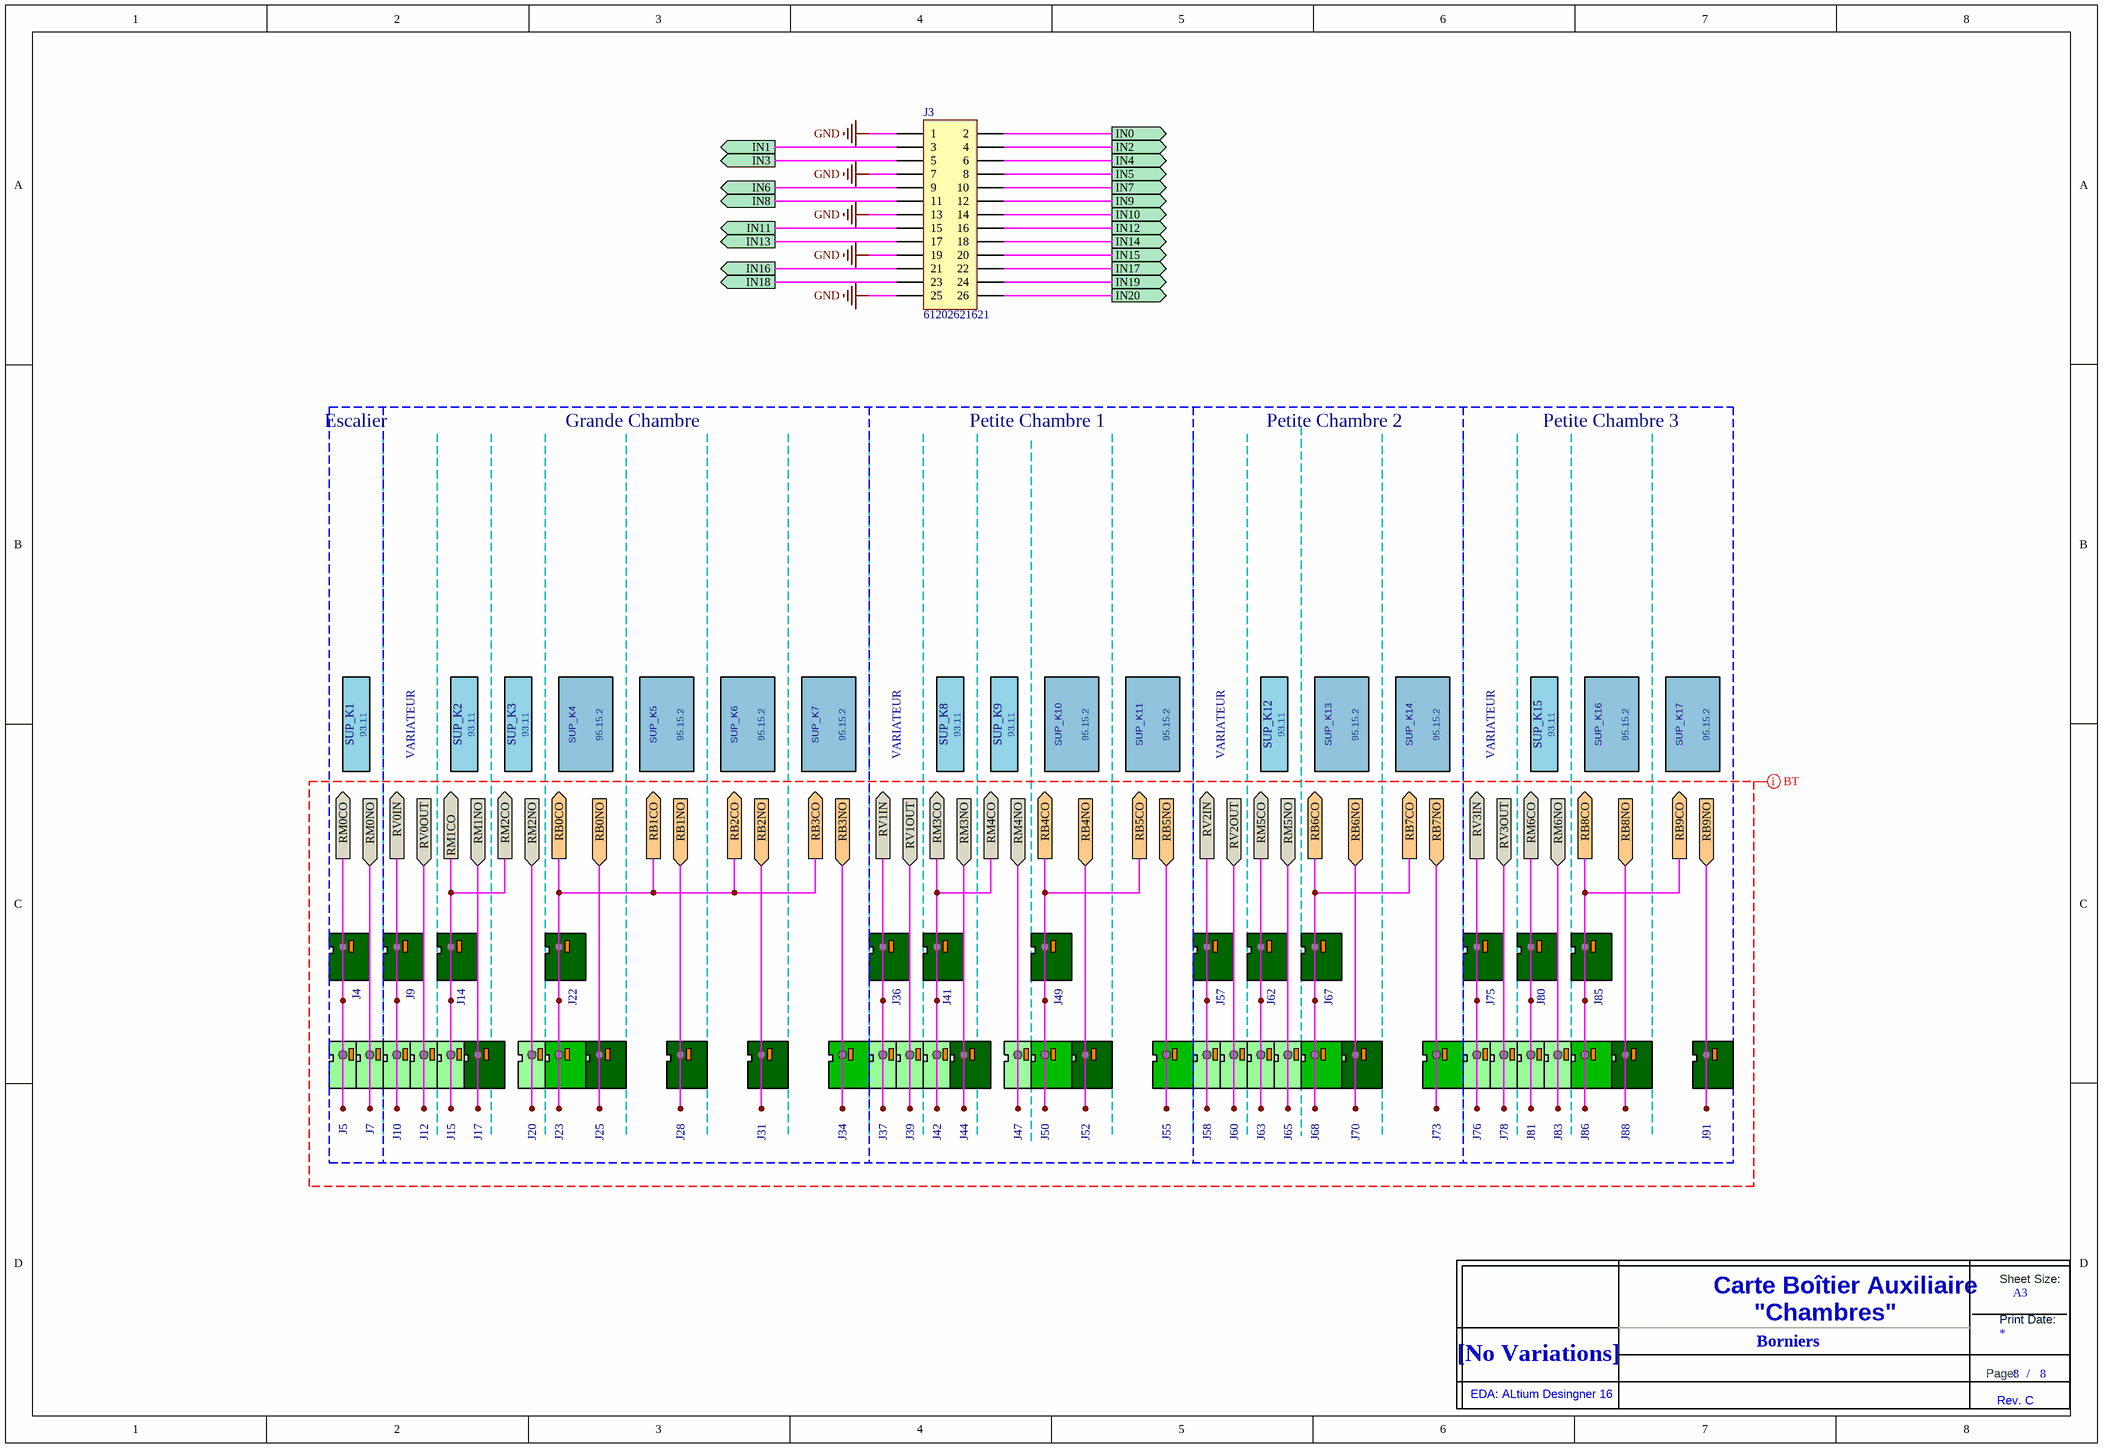
[diagram p8: SC942C-0B_Borniers.SchDoc]

### Parts
(Parts that share a designator on the sheet are numbered #1, #2 ... from top to bottom, then left to right.)
J3  61202621621  [IDC2P54_26P]
J4  BRESS_CI_D_7.62_01_FFKDSA1/V2  [BRESS_FFKDSA1/V2-7,62_P1.3]  (value not drawn)
J5  BRESS_CI_D_5.08_01_FFKDS/V2  [BRESS_FFKDS/V2-5,08_P1.3]  (value not drawn)
J7  BRESS_CI_D_5.08_01_FFKDS/V2  [BRESS_FFKDS/V2-5,08_P1.3]  (value not drawn)
J9  BRESS_CI_D_7.62_01_FFKDSA1/V2  [BRESS_FFKDSA1/V2-7,62_P1.3]  (value not drawn)
J10  BRESS_CI_D_5.08_01_FFKDS/V2  [BRESS_FFKDS/V2-5,08_P1.3]  (value not drawn)
J12  BRESS_CI_D_5.08_01_FFKDS/V2  [BRESS_FFKDS/V2-5,08_P1.3]  (value not drawn)
J14  BRESS_CI_D_7.62_01_FFKDSA1/V2  [BRESS_FFKDSA1/V2-7,62_P1.3]  (value not drawn)
J15  BRESS_CI_D_5.08_01_FFKDS/V2  [BRESS_FFKDS/V2-5,08_P1.3]  (value not drawn)
J17  BRESS_CI_D_7.62_01_FFKDSA1/V2  [BRESS_FFKDSA1/V2-7,62_P1.3]  (value not drawn)
J20  BRESS_CI_D_5.08_01_FFKDS/V2  [BRESS_FFKDS/V2-5,08_P1.3]  (value not drawn)
J22  BRESS_CI_D_7.62_01_FFKDSA1/V2  [BRESS_FFKDSA1/V2-7,62_P1.3]  (value not drawn)
J23  BRESS_CI_D_7.62_01_FFKDSA/V2  [BRESS_FFKDSA/V2-7,62_P1.3]  (value not drawn)
J25  BRESS_CI_D_7.62_01_FFKDSA1/V2  [BRESS_FFKDSA1/V2-7,62_P1.3]  (value not drawn)
J28  BRESS_CI_D_7.62_01_FFKDSA1/V2  [BRESS_FFKDSA1/V2-7,62_P1.3]  (value not drawn)
J31  BRESS_CI_D_7.62_01_FFKDSA1/V2  [BRESS_FFKDSA1/V2-7,62_P1.3]  (value not drawn)
J34  BRESS_CI_D_7.62_01_FFKDSA/V2  [BRESS_FFKDSA/V2-7,62_P1.3]  (value not drawn)
J36  BRESS_CI_D_7.62_01_FFKDSA1/V2  [BRESS_FFKDSA1/V2-7,62_P1.3]  (value not drawn)
J37  BRESS_CI_D_5.08_01_FFKDS/V2  [BRESS_FFKDS/V2-5,08_P1.3]  (value not drawn)
J39  BRESS_CI_D_5.08_01_FFKDS/V2  [BRESS_FFKDS/V2-5,08_P1.3]  (value not drawn)
J41  BRESS_CI_D_7.62_01_FFKDSA1/V2  [BRESS_FFKDSA1/V2-7,62_P1.3]  (value not drawn)
J42  BRESS_CI_D_5.08_01_FFKDS/V2  [BRESS_FFKDS/V2-5,08_P1.3]  (value not drawn)
J44  BRESS_CI_D_7.62_01_FFKDSA1/V2  [BRESS_FFKDSA1/V2-7,62_P1.3]  (value not drawn)
J47  BRESS_CI_D_5.08_01_FFKDS/V2  [BRESS_FFKDS/V2-5,08_P1.3]  (value not drawn)
J49  BRESS_CI_D_7.62_01_FFKDSA1/V2  [BRESS_FFKDSA1/V2-7,62_P1.3]  (value not drawn)
J50  BRESS_CI_D_7.62_01_FFKDSA/V2  [BRESS_FFKDSA/V2-7,62_P1.3]  (value not drawn)
J52  BRESS_CI_D_7.62_01_FFKDSA1/V2  [BRESS_FFKDSA1/V2-7,62_P1.3]  (value not drawn)
J55  BRESS_CI_D_7.62_01_FFKDSA/V2  [BRESS_FFKDSA/V2-7,62_P1.3]  (value not drawn)
J57  BRESS_CI_D_7.62_01_FFKDSA1/V2  [BRESS_FFKDSA1/V2-7,62_P1.3]  (value not drawn)
J58  BRESS_CI_D_5.08_01_FFKDS/V2  [BRESS_FFKDS/V2-5,08_P1.3]  (value not drawn)
J60  BRESS_CI_D_5.08_01_FFKDS/V2  [BRESS_FFKDS/V2-5,08_P1.3]  (value not drawn)
J62  BRESS_CI_D_7.62_01_FFKDSA1/V2  [BRESS_FFKDSA1/V2-7,62_P1.3]  (value not drawn)
J63  BRESS_CI_D_5.08_01_FFKDS/V2  [BRESS_FFKDS/V2-5,08_P1.3]  (value not drawn)
J65  BRESS_CI_D_5.08_01_FFKDS/V2  [BRESS_FFKDS/V2-5,08_P1.3]  (value not drawn)
J67  BRESS_CI_D_7.62_01_FFKDSA1/V2  [BRESS_FFKDSA1/V2-7,62_P1.3]  (value not drawn)
J68  BRESS_CI_D_7.62_01_FFKDSA/V2  [BRESS_FFKDSA/V2-7,62_P1.3]  (value not drawn)
J70  BRESS_CI_D_7.62_01_FFKDSA1/V2  [BRESS_FFKDSA1/V2-7,62_P1.3]  (value not drawn)
J73  BRESS_CI_D_7.62_01_FFKDSA/V2  [BRESS_FFKDSA/V2-7,62_P1.3]  (value not drawn)
J75  BRESS_CI_D_7.62_01_FFKDSA1/V2  [BRESS_FFKDSA1/V2-7,62_P1.3]  (value not drawn)
J76  BRESS_CI_D_5.08_01_FFKDS/V2  [BRESS_FFKDS/V2-5,08_P1.3]  (value not drawn)
J78  BRESS_CI_D_5.08_01_FFKDS/V2  [BRESS_FFKDS/V2-5,08_P1.3]  (value not drawn)
J80  BRESS_CI_D_7.62_01_FFKDSA1/V2  [BRESS_FFKDSA1/V2-7,62_P1.3]  (value not drawn)
J81  BRESS_CI_D_5.08_01_FFKDS/V2  [BRESS_FFKDS/V2-5,08_P1.3]  (value not drawn)
J83  BRESS_CI_D_5.08_01_FFKDS/V2  [BRESS_FFKDS/V2-5,08_P1.3]  (value not drawn)
J85  BRESS_CI_D_7.62_01_FFKDSA1/V2  [BRESS_FFKDSA1/V2-7,62_P1.3]  (value not drawn)
J86  BRESS_CI_D_7.62_01_FFKDSA/V2  [BRESS_FFKDSA/V2-7,62_P1.3]  (value not drawn)
J88  BRESS_CI_D_7.62_01_FFKDSA1/V2  [BRESS_FFKDSA1/V2-7,62_P1.3]  (value not drawn)
J91  BRESS_CI_D_7.62_01_FFKDSA1/V2  [BRESS_FFKDSA1/V2-7,62_P1.3]  (value not drawn)
SUP_K1  value 93.11  [RELAY-SUPPORT_FINDER_SERIE93]  (hidden comment: RELAY-SUPPORT_93.11)
SUP_K2  value 93.11  [RELAY-SUPPORT_FINDER_SERIE93]  (hidden comment: RELAY-SUPPORT_93.11)
SUP_K3  value 93.11  [RELAY-SUPPORT_FINDER_SERIE93]  (hidden comment: RELAY-SUPPORT_93.11)
SUP_K4  value 95.15.2  [RELAY-SUPPORT_FINDER_SERIE95]  (hidden comment: RELAY-SUPPORT_95.15.2)
SUP_K5  value 95.15.2  [RELAY-SUPPORT_FINDER_SERIE95]  (hidden comment: RELAY-SUPPORT_95.15.2)
SUP_K6  value 95.15.2  [RELAY-SUPPORT_FINDER_SERIE95]  (hidden comment: RELAY-SUPPORT_95.15.2)
SUP_K7  value 95.15.2  [RELAY-SUPPORT_FINDER_SERIE95]  (hidden comment: RELAY-SUPPORT_95.15.2)
SUP_K8  value 93.11  [RELAY-SUPPORT_FINDER_SERIE93]  (hidden comment: RELAY-SUPPORT_93.11)
SUP_K9  value 93.11  [RELAY-SUPPORT_FINDER_SERIE93]  (hidden comment: RELAY-SUPPORT_93.11)
SUP_K10  value 95.15.2  [RELAY-SUPPORT_FINDER_SERIE95]  (hidden comment: RELAY-SUPPORT_95.15.2)
SUP_K11  value 95.15.2  [RELAY-SUPPORT_FINDER_SERIE95]  (hidden comment: RELAY-SUPPORT_95.15.2)
SUP_K12  value 93.11  [RELAY-SUPPORT_FINDER_SERIE93]  (hidden comment: RELAY-SUPPORT_93.11)
SUP_K13  value 95.15.2  [RELAY-SUPPORT_FINDER_SERIE95]  (hidden comment: RELAY-SUPPORT_95.15.2)
SUP_K14  value 95.15.2  [RELAY-SUPPORT_FINDER_SERIE95]  (hidden comment: RELAY-SUPPORT_95.15.2)
SUP_K15  value 93.11  [RELAY-SUPPORT_FINDER_SERIE93]  (hidden comment: RELAY-SUPPORT_93.11)
SUP_K16  value 95.15.2  [RELAY-SUPPORT_FINDER_SERIE95]  (hidden comment: RELAY-SUPPORT_95.15.2)
SUP_K17  value 95.15.2  [RELAY-SUPPORT_FINDER_SERIE95]  (hidden comment: RELAY-SUPPORT_95.15.2)
Title_new?#8  DNI  (value not drawn)  (graphical)

### Ports
IN0 (out), IN1 (out), IN2 (out), IN3 (out), IN4 (out), IN5 (out), IN6 (out), IN7 (out), IN8 (out), IN9 (out), IN10 (out), IN11 (out), IN12 (out), IN13 (out), IN14 (out), IN15 (out), IN16 (out), IN17 (out), IN18 (out), IN19 (out), IN20 (out), RB0CO (out), RB0NO (in), RB1CO (out), RB1NO (in), RB2CO (out), RB2NO (in), RB3CO (out), RB3NO (in), RB4CO (out), RB4NO (in), RB5CO (out), RB5NO (in), RB6CO (out), RB6NO (in), RB7CO (out), RB7NO (in), RB8CO (out), RB8NO (in), RB9CO (out), RB9NO (in), RM0CO (out), RM0NO (in), RM1CO (out), RM1NO (in), RM2CO (out), RM2NO (in), RM3CO (out), RM3NO (in), RM4CO (out), RM4NO (in), RM5CO (out), RM5NO (in), RM6CO (out), RM6NO (in), RV0IN (out), RV0OUT (in), RV1IN (out), RV1OUT (in), RV2IN (out), RV2OUT (in), RV3IN (out), RV3OUT (in)

### Nets
GND: J3.1 J3.7 J3.13 J3.19 J3.25
IN0: J3.2 ; port IN0
IN1: J3.3 ; port IN1
IN2: J3.4 ; port IN2
IN3: J3.5 ; port IN3
IN4: J3.6 ; port IN4
IN5: J3.8 ; port IN5
IN6: J3.9 ; port IN6
IN7: J3.10 ; port IN7
IN8: J3.11 ; port IN8
IN9: J3.12 ; port IN9
IN10: J3.14 ; port IN10
IN11: J3.15 ; port IN11
IN12: J3.16 ; port IN12
IN13: J3.17 ; port IN13
IN14: J3.18 ; port IN14
IN15: J3.20 ; port IN15
IN16: J3.21 ; port IN16
IN17: J3.22 ; port IN17
IN18: J3.23 ; port IN18
IN19: J3.24 ; port IN19
IN20: J3.26 ; port IN20
RB0CO: J22.1 J22.2 J23.1 J23.2 ; port RB3CO, port RB2CO, port RB1CO, port RB0CO
RB0NO: J25.1 J25.2 ; port RB0NO
RB1NO: J28.1 J28.2 ; port RB1NO
RB2NO: J31.1 J31.2 ; port RB2NO
RB3NO: J34.1 J34.2 ; port RB3NO
RB4CO: J49.1 J49.2 J50.1 J50.2 ; port RB5CO, port RB4CO
RB4NO: J52.1 J52.2 ; port RB4NO
RB5NO: J55.1 J55.2 ; port RB5NO
RB6CO: J67.1 J67.2 J68.1 J68.2 ; port RB7CO, port RB6CO
RB6NO: J70.1 J70.2 ; port RB6NO
RB7NO: J73.1 J73.2 ; port RB7NO
RB8CO: J85.1 J85.2 J86.1 J86.2 ; port RB9CO, port RB8CO
RB8NO: J88.1 J88.2 ; port RB8NO
RB9NO: J91.1 J91.2 ; port RB9NO
RM0CO: J4.1 J4.2 J5.1 J5.2 ; port RM0CO
RM0NO: J7.1 J7.2 ; port RM0NO
RM1CO: J14.1 J14.2 J15.1 J15.2 ; port RM1CO, port RM2CO
RM1NO: J17.1 J17.2 ; port RM1NO
RM2NO: J20.1 J20.2 ; port RM2NO
RM3CO: J41.1 J41.2 J42.1 J42.2 ; port RM3CO, port RM4CO
RM3NO: J44.1 J44.2 ; port RM3NO
RM4NO: J47.1 J47.2 ; port RM4NO
RM5CO: J62.1 J62.2 J63.1 J63.2 ; port RM5CO
RM5NO: J65.1 J65.2 ; port RM5NO
RM6CO: J80.1 J80.2 J81.1 J81.2 ; port RM6CO
RM6NO: J83.1 J83.2 ; port RM6NO
RV0IN: J9.1 J9.2 J10.1 J10.2 ; port RV0IN
RV0OUT: J12.1 J12.2 ; port RV0OUT
RV1IN: J36.1 J36.2 J37.1 J37.2 ; port RV1IN
RV1OUT: J39.1 J39.2 ; port RV1OUT
RV2IN: J57.1 J57.2 J58.1 J58.2 ; port RV2IN
RV2OUT: J60.1 J60.2 ; port RV2OUT
RV3IN: J75.1 J75.2 J76.1 J76.2 ; port RV3IN
RV3OUT: J78.1 J78.2 ; port RV3OUT

### Layout directives
net class BT: (no net found under the mark)

### Notes on the sheet
- Escalier
- Grande Chambre
- Petite Chambre 1
- Petite Chambre 2
- Petite Chambre 3
- VARIATEUR
- Borniers
- (in symbol Title_new_1) Sheet Size:; Carte Boîtier Auxiliaire; A3; "Chambres"; Print Date:; [No Variations]; Page:; /; EDA: ALtium Desingner 16; Rev. C

### Library data of the parts
J3 = Header 13X2: 26 Positions Header, Shrouded Connector 0.100" (2.54mm) Through Hole Gold; Manufacturer: Wurth Electronics Inc; Fabricant: Wurth Elektronik; Supplier 1: Digi-Key; Supplier Part Number 1: 732-2097-ND; Manufacturer Part Number: 61202621621; Reference: 61202621621; Value: 61202621621
J4 J9 J14 J17 J22 J25 J28 J31 J36 J41 J44 J49 J52 J57 J62 J67 J70 J75 J80 J85 J88 J91 = BRESS_CI_D_7.62_01_FFKDSA1/V2: Bornier à connexion par ressorts/déconnexion par levier, série FFKDSA1/V2, e7.62, 1x1pts, droit, juxtaposable, 500V/17.5A, AWG22~16, Vert/Orange; Creation: LJ (21/11/11); Boitier: 7.62x10_h15.8_e7.62_p1.3mm; Remarque: {Remarque}; Fabricant: Phoenix Contact; Ref Fab: 1790487; Coeff: 1; Value: FFKDSA1/V2-7,62; Verification: *; ComponentLink1URL: o:\_Documentation\Datasheets\Phoenix\FFKDSA1-V2_7,62_1790487.pdf; ComponentLink2URL: o:\_Documentation\Datasheets\_BOITIERS\; Config: *; ComponentLink1Description: Datasheet; ComponentLink2Description: Datasheet
J5 J7 J10 J12 J15 J20 J37 J39 J42 J47 J58 J60 J63 J65 J76 J78 J81 J83 = BRESS_CI_D_5.08_01_FFKDS/V2: Bornier à connexion par ressorts/déconnexion par levier, série FFKDS/V2, e5.08, 1x1pts, droit, juxtaposable, 320V/15A, AWG22~16, Vert/Orange; Creation: LJ (21/11/11); Boitier: 5.08x10_h15.8_e5.08_p1.3mm; Remarque: {Remarque}; Fabricant: Phoenix Contact; Ref Fab: 1790348; Coeff: 1; Value: FFKDS/V2-5,08; Verification: *; ComponentLink1URL: o:\_Documentation\Datasheets\Phoenix\FFKDS-V2_5,08_1790348.pdf; ComponentLink2URL: o:\_Documentation\Datasheets\_BOITIERS\; Config: *; ComponentLink1Description: Datasheet; ComponentLink2Description: Datasheet
J23 J34 J50 J55 J68 J73 J86 = BRESS_CI_D_7.62_01_FFKDSA/V2: Bornier à connexion par ressorts/déconnexion par levier, série FFKDSA/V2, e7.62, 1x1pts, droit, juxtaposable, 500V/17.5A, AWG22~16, Vert/Orange; Creation: LJ (21/11/11); Boitier: 7.62x10_h15.8_e7.62_p1.3mm; Remarque: {Remarque}; Fabricant: Phoenix Contact; Ref Fab: 1790377; Coeff: 1; Value: FFKDSA/V2-7,62; Verification: *; ComponentLink1URL: o:\_Documentation\Datasheets\Phoenix\FFKDSA-V2_7,62_1790377.pdf; ComponentLink2URL: o:\_Documentation\Datasheets\_BOITIERS\; Config: *; ComponentLink1Description: Datasheet; ComponentLink2Description: Datasheet
SUP_K1-SUP_K3 SUP_K8 SUP_K9 SUP_K12 SUP_K15 = RELAY-SUPPORT_93.11: Suppor série 93 pour relais Finder séries 34, 250V/6A, Bleu; Creation: LJ (24/11/11); Remarque: {Remarque}; Coeff: 1; Fabricant: Finder; Ref Fab: 93.11; ComponentLink1URL: o:\_Documentation\Datasheets\Finder\Relais_Serie_34.pdf; ComponentLink2URL: o:\_Documentation\Datasheets\; Config: *; ComponentLink1Description: Datasheet; ComponentLink2Description: Datasheet Boitier
SUP_K4-SUP_K7 SUP_K10 SUP_K11 SUP_K13 SUP_K14 SUP_K16 SUP_K17 = RELAY-SUPPORT_95.15.2: Suppor série 95 pour relais Finder séries 40, 250V/10A, Bleu, sans Etrier; Creation: LJ (11/06/12); Remarque: {Remarque}; Coeff: 1; Fabricant: Finder; Ref Fab: 95.15.2; ComponentLink1URL: o:\_Documentation\Datasheets\Finder\Relais_Serie_40.pdf; ComponentLink2URL: o:\_Documentation\Datasheets\; Config: *; ComponentLink1Description: Datasheet; ComponentLink2Description: Datasheet Boitier
Title_new?#8 = Title_new_1

## Nets that join several sheets
+5V: SC942C_Coeur (17 pins), SC942C_Variateurs (8 pins), SC942C_STORRB (R56.2 R57.2)
+12V: SC942C_Coeur (6 pins), SC942C_ETOR1 (12 pins), SC942C_ETOR2 (9 pins), SC942C_STORRM (14 pins), SC942C_STORRB (13 pins)
GND: SC942C_Coeur (30 pins), SC942C_ETOR1 (36 pins), SC942C_ETOR2 (27 pins), SC942C_STORRM (14 pins), SC942C_Variateurs (8 pins), SC942C_STORRB (C40.2 C41.1 U7.3), SC942C-0B_Borniers (5 pins)
IN0: SC942C_ETOR1 (D11.K R10.1 R13.1 R14.2), SC942C-0B_Borniers (J3.2)
IN0_UC: SC942C_Coeur (U5.15), SC942C_ETOR1 (C7.2 R13.2)
IN1: SC942C_ETOR1 (D14.K R16.1 R19.1 R20.2), SC942C-0B_Borniers (J3.3)
IN1_UC: SC942C_Coeur (U5.14), SC942C_ETOR1 (C9.2 R19.2)
IN2: SC942C_ETOR1 (D17.K R22.1 R25.1 R26.2), SC942C-0B_Borniers (J3.4)
IN2_UC: SC942C_Coeur (U5.13), SC942C_ETOR1 (C11.2 R25.2)
IN3: SC942C_ETOR1 (D20.K R30.1 R31.1 R32.2), SC942C-0B_Borniers (J3.5)
IN3_UC: SC942C_Coeur (U5.12), SC942C_ETOR1 (C13.2 R30.2)
IN4: SC942C_ETOR1 (D22.K R34.1 R37.1 R38.2), SC942C-0B_Borniers (J3.6)
IN4_UC: SC942C_Coeur (U5.11), SC942C_ETOR1 (C15.2 R37.2)
IN5: SC942C_ETOR1 (D10.K R9.1 R11.1 R12.2), SC942C-0B_Borniers (J3.8)
IN5_UC: SC942C_Coeur (U5.8), SC942C_ETOR1 (C6.2 R11.2)
IN6: SC942C_ETOR1 (D13.K R15.1 R17.1 R18.2), SC942C-0B_Borniers (J3.9)
IN6_UC: SC942C_Coeur (U5.7), SC942C_ETOR1 (C8.2 R17.2)
IN7: SC942C_ETOR1 (D16.K R21.1 R23.1 R24.2), SC942C-0B_Borniers (J3.10)
IN7_UC: SC942C_Coeur (U5.6), SC942C_ETOR1 (C10.2 R23.2)
IN8: SC942C_ETOR1 (D19.K R27.1 R28.1 R29.2), SC942C-0B_Borniers (J3.11)
IN8_UC: SC942C_Coeur (U5.5), SC942C_ETOR1 (C12.2 R27.2)
IN9: SC942C_ETOR1 (D21.K R33.1 R35.1 R36.2), SC942C-0B_Borniers (J3.12)
IN9_UC: SC942C_Coeur (U5.4), SC942C_ETOR1 (C14.2 R35.2)
IN10: SC942C_ETOR1 (D24.K R39.1 R40.1 R41.2), SC942C-0B_Borniers (J3.14)
IN10_UC: SC942C_Coeur (U5.3), SC942C_ETOR1 (C16.2 R40.2)
IN11: SC942C_ETOR1 (D25.K R42.1 R43.1 R44.2), SC942C-0B_Borniers (J3.15)
IN11_UC: SC942C_Coeur (U5.2), SC942C_ETOR1 (C18.2 R42.2)
IN12: SC942C_ETOR2 (D27.K R46.1 R48.1 R49.2), SC942C-0B_Borniers (J3.16)
IN12_UC: SC942C_Coeur (U5.1), SC942C_ETOR2 (C19.2 R48.2)
IN13: SC942C_ETOR2 (D31.K R53.1 R54.2 R55.1), SC942C-0B_Borniers (J3.17)
IN13_UC: SC942C_Coeur (U5.64), SC942C_ETOR2 (C30.2 R53.2)
IN14: SC942C_ETOR2 (D33.K R59.1 R60.2 R61.1), SC942C-0B_Borniers (J3.18)
IN14_UC: SC942C_Coeur (U5.63), SC942C_ETOR2 (C32.2 R59.2)
IN15: SC942C_ETOR2 (D35.K R62.1 R63.2 R64.1), SC942C-0B_Borniers (J3.20)
IN15_UC: SC942C_Coeur (U5.60), SC942C_ETOR2 (C33.2 R62.2)
IN16: SC942C_ETOR2 (D37.K R65.1 R66.2 R67.1), SC942C-0B_Borniers (J3.21)
IN16_UC: SC942C_Coeur (U5.59), SC942C_ETOR2 (C34.2 R65.2)
IN17: SC942C_ETOR2 (D38.K R68.1 R69.2 R70.1), SC942C-0B_Borniers (J3.22)
IN17_UC: SC942C_Coeur (U5.53), SC942C_ETOR2 (C35.2 R68.2)
IN18: SC942C_ETOR2 (D39.K R71.1 R72.2 R73.1), SC942C-0B_Borniers (J3.23)
IN18_UC: SC942C_Coeur (U5.52), SC942C_ETOR2 (C36.2 R71.2)
IN19: SC942C_ETOR2 (D42.K R75.1 R76.2 R77.1), SC942C-0B_Borniers (J3.24)
IN19_UC: SC942C_Coeur (U5.51), SC942C_ETOR2 (C38.2 R75.2)
IN20: SC942C_ETOR2 (D43.K R78.1 R79.2 R80.1), SC942C-0B_Borniers (J3.26)
IN20_UC: SC942C_Coeur (U5.50), SC942C_ETOR2 (C39.2 R78.2)
RB0_UC: SC942C_Coeur (U5.29), SC942C_STORRB (T4.1 T5.1)
RB0CO: SC942C_STORRB (8 pins), SC942C-0B_Borniers (J22.1 J22.2 J23.1 J23.2)
RB0NO: SC942C_STORRB (K4.14 K4.24), SC942C-0B_Borniers (J25.1 J25.2)
RB1_UC: SC942C_Coeur (U5.30), SC942C_STORRB (T6.1 T7.1)
RB1NO: SC942C_STORRB (K5.14 K5.24), SC942C-0B_Borniers (J28.1 J28.2)
RB2_UC: SC942C_Coeur (U5.31), SC942C_STORRB (T8.1 T9.1)
RB2NO: SC942C_STORRB (K6.14 K6.24), SC942C-0B_Borniers (J31.1 J31.2)
RB3_UC: SC942C_Coeur (U5.32), SC942C_STORRB (T10.1 T11.1)
RB3NO: SC942C_STORRB (K7.14 K7.24), SC942C-0B_Borniers (J34.1 J34.2)
RB4_UC: SC942C_Coeur (U5.34), SC942C_STORRB (T14.1 T15.1)
RB4CO: SC942C_STORRB (K10.11 K10.21 K11.11 K11.21), SC942C-0B_Borniers (J49.1 J49.2 J50.1 J50.2)
RB4NO: SC942C_STORRB (K10.14 K10.24), SC942C-0B_Borniers (J52.1 J52.2)
RB5_UC: SC942C_Coeur (U5.37), SC942C_STORRB (T16.1 T17.1)
RB5NO: SC942C_STORRB (K11.14 K11.24), SC942C-0B_Borniers (J55.1 J55.2)
RB6_UC: SC942C_Coeur (U5.44), SC942C_STORRB (T19.1 T20.1)
RB6CO: SC942C_STORRB (K13.11 K13.21 K14.11 K14.21), SC942C-0B_Borniers (J67.1 J67.2 J68.1 J68.2)
RB6NO: SC942C_STORRB (K13.14 K13.24), SC942C-0B_Borniers (J70.1 J70.2)
RB7_UC: SC942C_Coeur (U5.45), SC942C_STORRB (T21.1 T22.1)
RB7NO: SC942C_STORRB (K14.14 K14.24), SC942C-0B_Borniers (J73.1 J73.2)
RB8_UC: SC942C_Coeur (U5.46), SC942C_STORRB (T24.1 T25.1)
RB8CO: SC942C_STORRB (K16.11 K16.21 K17.11 K17.21), SC942C-0B_Borniers (J85.1 J85.2 J86.1 J86.2)
RB8NO: SC942C_STORRB (K16.14 K16.24), SC942C-0B_Borniers (J88.1 J88.2)
RB9_UC: SC942C_Coeur (U5.47), SC942C_STORRB (T26.1 T27.1)
RB9NO: SC942C_STORRB (K17.14 K17.24), SC942C-0B_Borniers (J91.1 J91.2)
RBSENS1_UC: SC942C_Coeur (U5.55), SC942C_STORRB (R56.1 U7.2)
RBSENS2_UC: SC942C_Coeur (U5.54), SC942C_STORRB (R57.1 U7.4)
RM0_UC: SC942C_Coeur (U5.18), SC942C_STORRM (R6.2 T1.1)
RM0CO: SC942C_STORRM (K1.11), SC942C-0B_Borniers (J4.1 J4.2 J5.1 J5.2)
RM0NO: SC942C_STORRM (K1.14), SC942C-0B_Borniers (J7.1 J7.2)
RM1_UC: SC942C_Coeur (U5.21), SC942C_STORRM (R7.2 T2.1)
RM1CO: SC942C_STORRM (K2.11 K3.11), SC942C-0B_Borniers (J14.1 J14.2 J15.1 J15.2)
RM1NO: SC942C_STORRM (K2.14), SC942C-0B_Borniers (J17.1 J17.2)
RM2_UC: SC942C_Coeur (U5.22), SC942C_STORRM (R8.2 T3.1)
RM2NO: SC942C_STORRM (K3.14), SC942C-0B_Borniers (J20.1 J20.2)
RM3_UC: SC942C_Coeur (U5.27), SC942C_STORRM (R45.2 T12.1)
RM3CO: SC942C_STORRM (K8.11 K9.11), SC942C-0B_Borniers (J41.1 J41.2 J42.1 J42.2)
RM3NO: SC942C_STORRM (K8.14), SC942C-0B_Borniers (J44.1 J44.2)
RM4_UC: SC942C_Coeur (U5.33), SC942C_STORRM (R47.2 T13.1)
RM4NO: SC942C_STORRM (K9.14), SC942C-0B_Borniers (J47.1 J47.2)
RM5_UC: SC942C_Coeur (U5.42), SC942C_STORRM (R58.2 T18.1)
RM5CO: SC942C_STORRM (K12.11), SC942C-0B_Borniers (J62.1 J62.2 J63.1 J63.2)
RM5NO: SC942C_STORRM (K12.14), SC942C-0B_Borniers (J65.1 J65.2)
RM6_UC: SC942C_Coeur (U5.43), SC942C_STORRM (R74.2 T23.1)
RM6CO: SC942C_STORRM (K15.11), SC942C-0B_Borniers (J80.1 J80.2 J81.1 J81.2)
RM6NO: SC942C_STORRM (K15.14), SC942C-0B_Borniers (J83.1 J83.2)
RV0_UC: SC942C_Coeur (U5.16), SC942C_Variateurs (U2.2UC)
RV0IN: SC942C_Variateurs (U2.1TR U2.2TR VR1.2), SC942C-0B_Borniers (J9.1 J9.2 J10.1 J10.2)
RV0OUT: SC942C_Variateurs (U2.3TR U2.4TR VR1.1), SC942C-0B_Borniers (J12.1 J12.2)
RV1_UC: SC942C_Coeur (U5.17), SC942C_Variateurs (U3.2UC)
RV1IN: SC942C_Variateurs (U3.1TR U3.2TR VR2.2), SC942C-0B_Borniers (J36.1 J36.2 J37.1 J37.2)
RV1OUT: SC942C_Variateurs (U3.3TR U3.4TR VR2.1), SC942C-0B_Borniers (J39.1 J39.2)
RV2_UC: SC942C_Coeur (U5.48), SC942C_Variateurs (U6.2UC)
RV2IN: SC942C_Variateurs (U6.1TR U6.2TR VR3.2), SC942C-0B_Borniers (J57.1 J57.2 J58.1 J58.2)
RV2OUT: SC942C_Variateurs (U6.3TR U6.4TR VR3.1), SC942C-0B_Borniers (J60.1 J60.2)
RV3_UC: SC942C_Coeur (U5.49), SC942C_Variateurs (U8.2UC)
RV3IN: SC942C_Variateurs (U8.1TR U8.2TR VR4.2), SC942C-0B_Borniers (J75.1 J75.2 J76.1 J76.2)
RV3OUT: SC942C_Variateurs (U8.3TR U8.4TR VR4.1), SC942C-0B_Borniers (J78.1 J78.2)

## Assembly variants
SC942-0B: not fitted C27 C29